# EAGLE design max31855 (EAGLE 8.1.0)
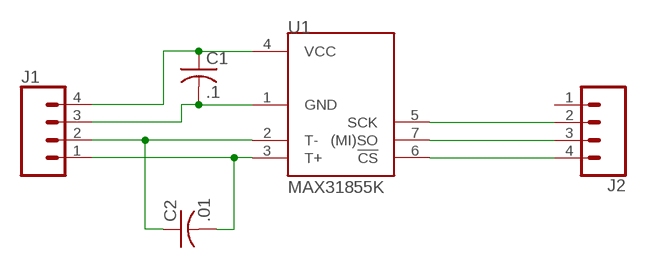
[diagram p0: schematic, sheet 1]

## Parts
C1  .1  C-USC0805  [C0805]
C2  .01  C-USC0805  [C0805]
J1  CONN_04  [1X04]
J2  CONN_04  [1X04]
U1  MAX31855K  [SO08]

## Nets
N$1: J2.4 U1.6(!CS)
N$2: J2.3 U1.7((MI)SO)
N$3: J2.2 U1.5(SCK)
N$4: C2.2 J1.1 U1.3(T+)
N$5: C2.1 J1.2 U1.2(T-)
N$6: C1.1 J1.4 U1.4(VCC)
N$7: C1.2 J1.3 U1.1(GND)
Unconnected: J2.1

## Library data of the parts
C1 C2 = resistor:C-US: CAPACITOR, American symbol
J1 J2 = SparkFun-Connectors:CONN_04: Multi connection point. Often used as Generic Header-pin footprint for 0.1 inch spaced/style header connections On any of the 0.1 inch spaced packages, you can populate with these: Break Away Headers - Straight <https://www.sparkfun.com/products/116> (PRT-00116) Break Away Male Headers - Right Angle <https://www.sparkfun.com/products/553> (PRT-00553) Female Headers <https://www.sparkfun.com/products/115> (PRT-00115) Break Away Headers - Machine Pin <https://www.sparkfun.com/products/117> (PRT-00117) Break Away Female Headers - Swiss Machine Pin <https://www.sparkfun.com/products/743> (PRT-00743) For SCREWTERMINALS and SPRING TERMINALS visit here: Screw Terimnals on SparkFun.com <https://www.sparkfun.com/search/results?term=Screw+Terminals> (5mm/3.5mm/2.54mm spacing) This device is also useful as a general connection point to wire up your design to another part of your project. Our various solder wires solder well into these plated through hole pads. Hook-Up Wire - Assortment (Stranded, 22 AWG) <https://www.sparkfun.com/products/11375> (PRT-11375) Hook-Up Wire - Assortment (Solid Core, 22 AWG) <https://www.sparkfun.com/products/11367> (PRT-11367) View the entire wire category on our website here <https://www.sparkfun.com/categories/141> Special notes: Molex polarized connector foot print use with SKU : PRT-08231 with associated crimp pins and housings. 1MM SMD Version SKU: PRT-10208; PROD_ID: CONN-09696
U1 = SparkFun-IC-Conversion:MAX31855K: Cold-Junction-Compensated K-Thermocoupleto-Digital Converter (-270°C to +1800°C) The MAX31855K performs cold-junction compensation and digitizes the signal from a type-K thermocouple. The data is output in a 14-bit resolution, SPI™-compatible, read-only format. This converter resolves temperatures to 0.25°C, allows readings as high as +1800°C and as low as -270°C, and exhibits thermocouple accuracy of ±2°C for temperatures ranging from -200°C to +700°C for K-type thermocouples. Datasheet <https://cdn.sparkfun.com/datasheets/Sensors/Temp/MAX31855K.pdf> SparkFun Products SparkFun Thermocouple Breakout - MAX31855K <https://www.sparkfun.com/products/13266> (SEN-13266); PROD_ID: IC-12578

## Board
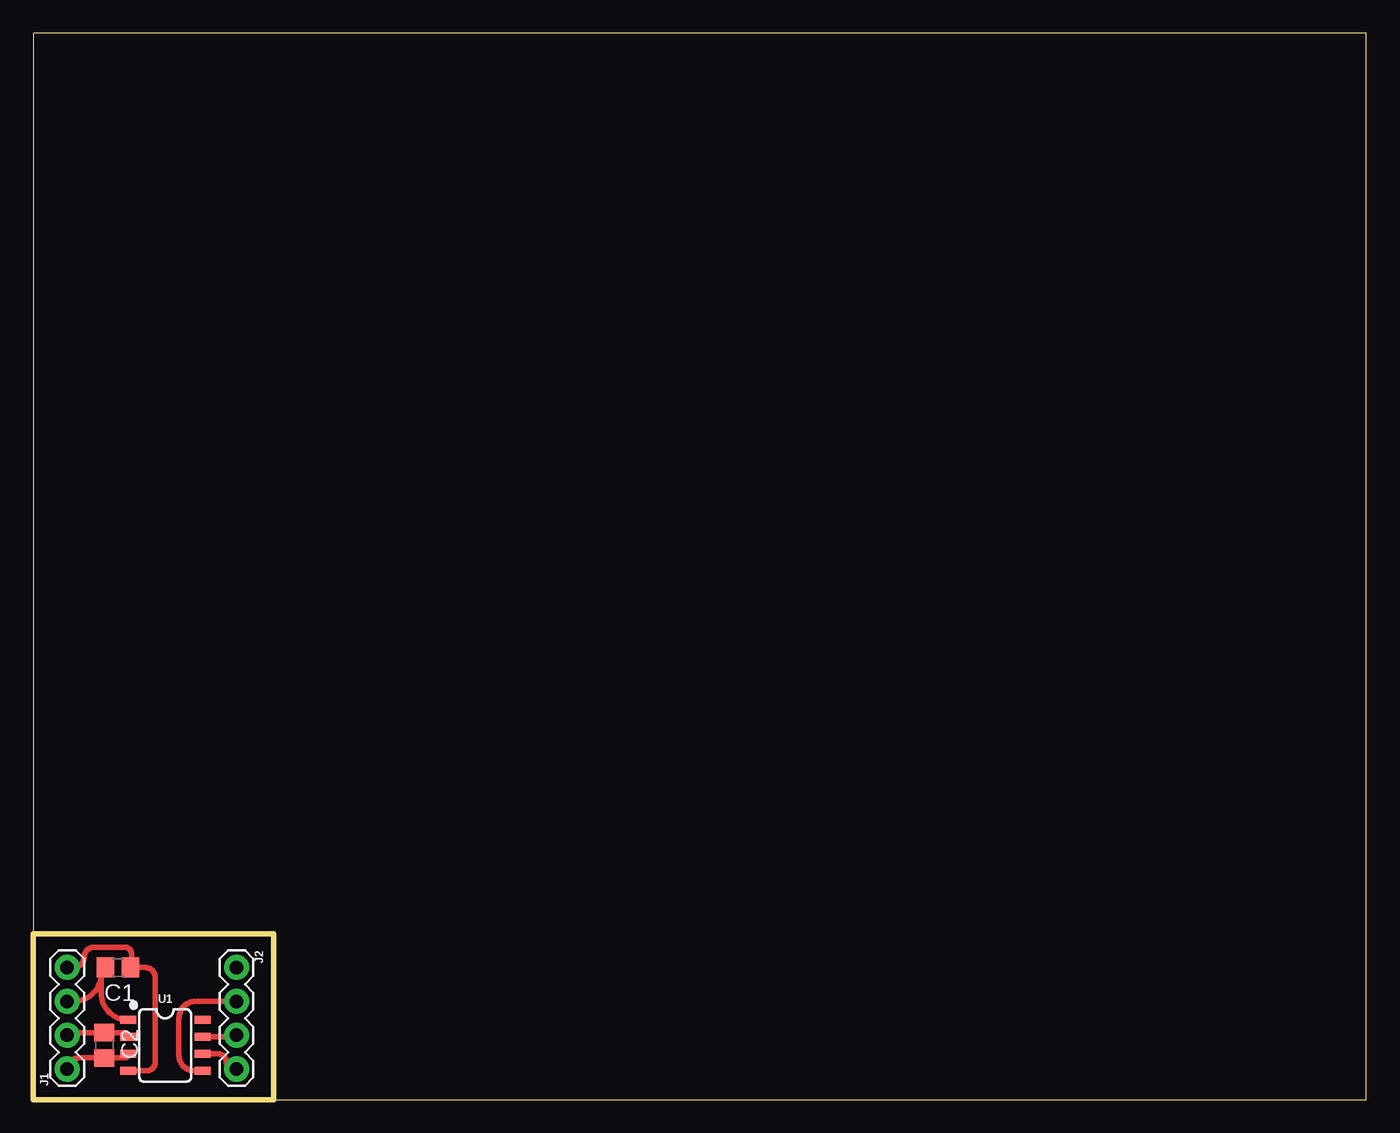
[diagram p1: board, top side]

Size 100 x 80 mm. Coordinates in mm from the lower left corner, seen from the top.
Outline: 18.03,0 100,0 100,80 0,80 0,12.45
Outline: 0,12.45 0,0 18.03,0
Outline: 0,12.45 18.03,12.45 18.03,0
Copper layers (1*16): Top 0.035mm / dielectric 1.5mm / Bottom 0.035mm
Design rules "default": minimum track width 10mil, minimum drill 24mil, track to track 8mil, track to pad 8mil, pad to pad 8mil, via to via 8mil, smd to smd 8mil, copper to edge 40mil, drill to drill 8mil, minimum pad ring 10mil, minimum via ring 8mil, stop-mask expansion 4mil, vias tented up to drill 0mil, thermal gap 10mil

### Footprints (pad centres in the part's own frame; a part is rotated, then mirrored left to right if it is on the bottom)
C0805 = smd 1.3 x 1.5: 1 -0.95,0; 2 0.95,0
1X04 = drill 1.016 pad 1.88: 1 0,0; 2 2.54,0; 3 5.08,0; 4 7.62,0
SO08 = smd 0.6 x 1.2: 1 -1.905,-2.8; 2 -0.635,-2.8; 3 0.635,-2.8; 4 1.905,-2.8; 5 1.905,2.8; 6 0.635,2.8; 7 -0.635,2.8; 8 -1.905,2.8

### Placement (x,y rotation side)
C1  6.35,9.91 180 top
C2  5.33,4.06 270 top
J1  2.54,2.29 90 top
J2  15.24,9.91 270 top
U1  9.91,4.06 270 top

### Tracks (layer width: path | path; a pad name or v marks a point on that pad's centre or on a via)
N$1
  Top 0.406: U1.6 13.84,3.43 arc-90 14.48,2.79 arc113 J2.4
N$2
  Top 0.406: U1.7 15.11,4.7 arc90 J2.3
N$3
  Top 0.406: U1.5 12.06,2.16 arc-90 10.92,3.3 10.92,6.1 arc-90 12.19,7.37 J2.2
N$4
  Top 0.406: U1.3 arc-90 6.79,3.11 C2.2 3.37,3.11 arc90 J1.1
N$5
  Top 0.406: U1.2 arc90 6.79,5.01 C2.1 2.73,5.01 arc90 J1.2
N$6
  Top 0.406: J1.4 3.05,9.91 arc90 3.81,10.67 arc-90 4.57,11.43 6.86,11.43 arc-90 7.37,10.92 7.37,9.97 arc-90 C1.1 8.38,9.91 arc-90 9.14,9.14 9.14,2.79 arc-90 8.51,2.16 U1.4
N$7
  Top 0.406: J1.3 3.05,7.37 arc90 5.08,9.4 | 5.08,9.4 5.08,8 arc90 U1.1 | C1.2 5.4,9.72 arc-90 5.08,9.4